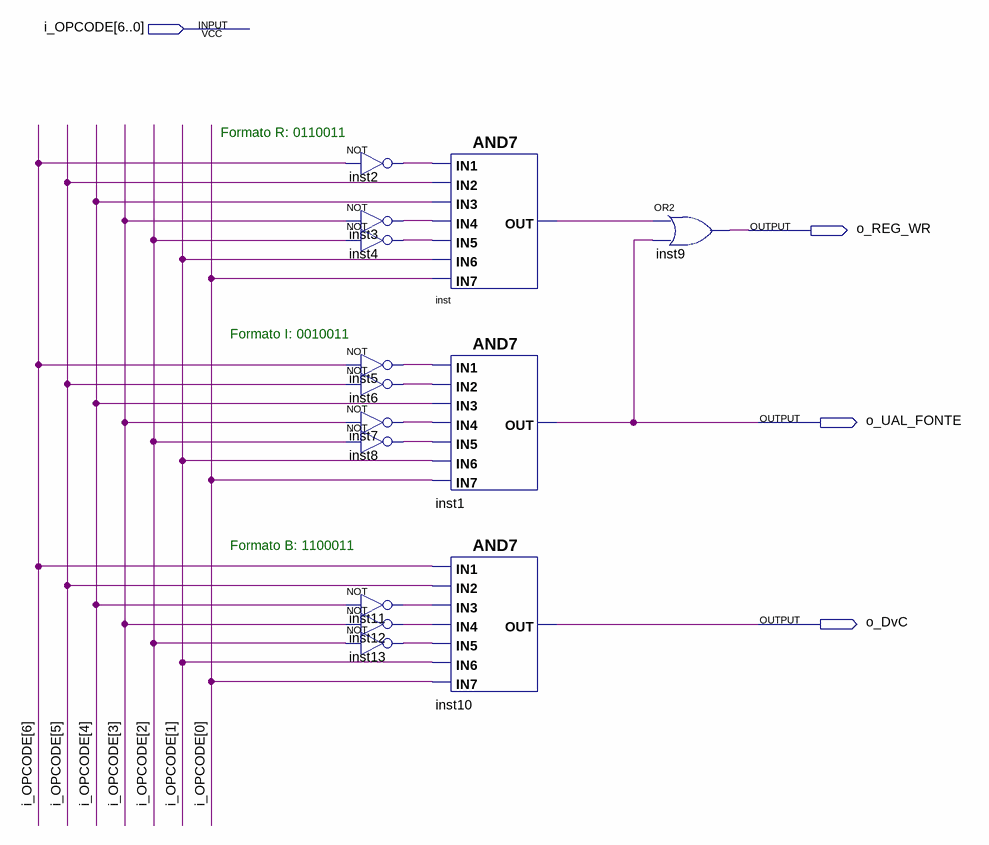
[diagram p0: schematic sheet]
// Quartus schematic controle.bdf as structural Verilog: 14 symbols, 4 pins
module controle (
  input  [6:0] i_OPCODE,
  output o_REG_WR,
  output o_UAL_FONTE,
  output o_DvC
);

  wire inst2_out, inst3_out, inst4_out, inst5_out, inst6_out, inst7_out, inst8_out, inst11_out, inst12_out,
       inst13_out, inst_out;

  not inst2 (inst2_out, i_OPCODE[6]);
  not inst3 (inst3_out, i_OPCODE[3]);
  not inst4 (inst4_out, i_OPCODE[2]);
  not inst5 (inst5_out, i_OPCODE[6]);
  not inst6 (inst6_out, i_OPCODE[5]);
  not inst7 (inst7_out, i_OPCODE[3]);
  not inst8 (inst8_out, i_OPCODE[2]);
  not inst11 (inst11_out, i_OPCODE[4]);
  not inst12 (inst12_out, i_OPCODE[3]);
  not inst13 (inst13_out, i_OPCODE[2]);
  and inst (inst_out, inst2_out, i_OPCODE[5], i_OPCODE[4], inst3_out, inst4_out, i_OPCODE[1], i_OPCODE[0]);
  and inst1 (o_UAL_FONTE, inst5_out, inst6_out, i_OPCODE[4], inst7_out, inst8_out, i_OPCODE[1], i_OPCODE[0]);
  and inst10 (o_DvC, i_OPCODE[6], i_OPCODE[5], inst11_out, inst12_out, inst13_out, i_OPCODE[1], i_OPCODE[0]);
  or inst9 (o_REG_WR, inst_out, o_UAL_FONTE);

  // Notes on the sheet:
  //   Formato R: 0110011
  //   Formato I: 0010011
  //   Formato B: 1100011
endmodule
